# Altium schematic sheet HumRigid1.SchDoc
size A4; SheetNumber: 1; SheetTotal: 2
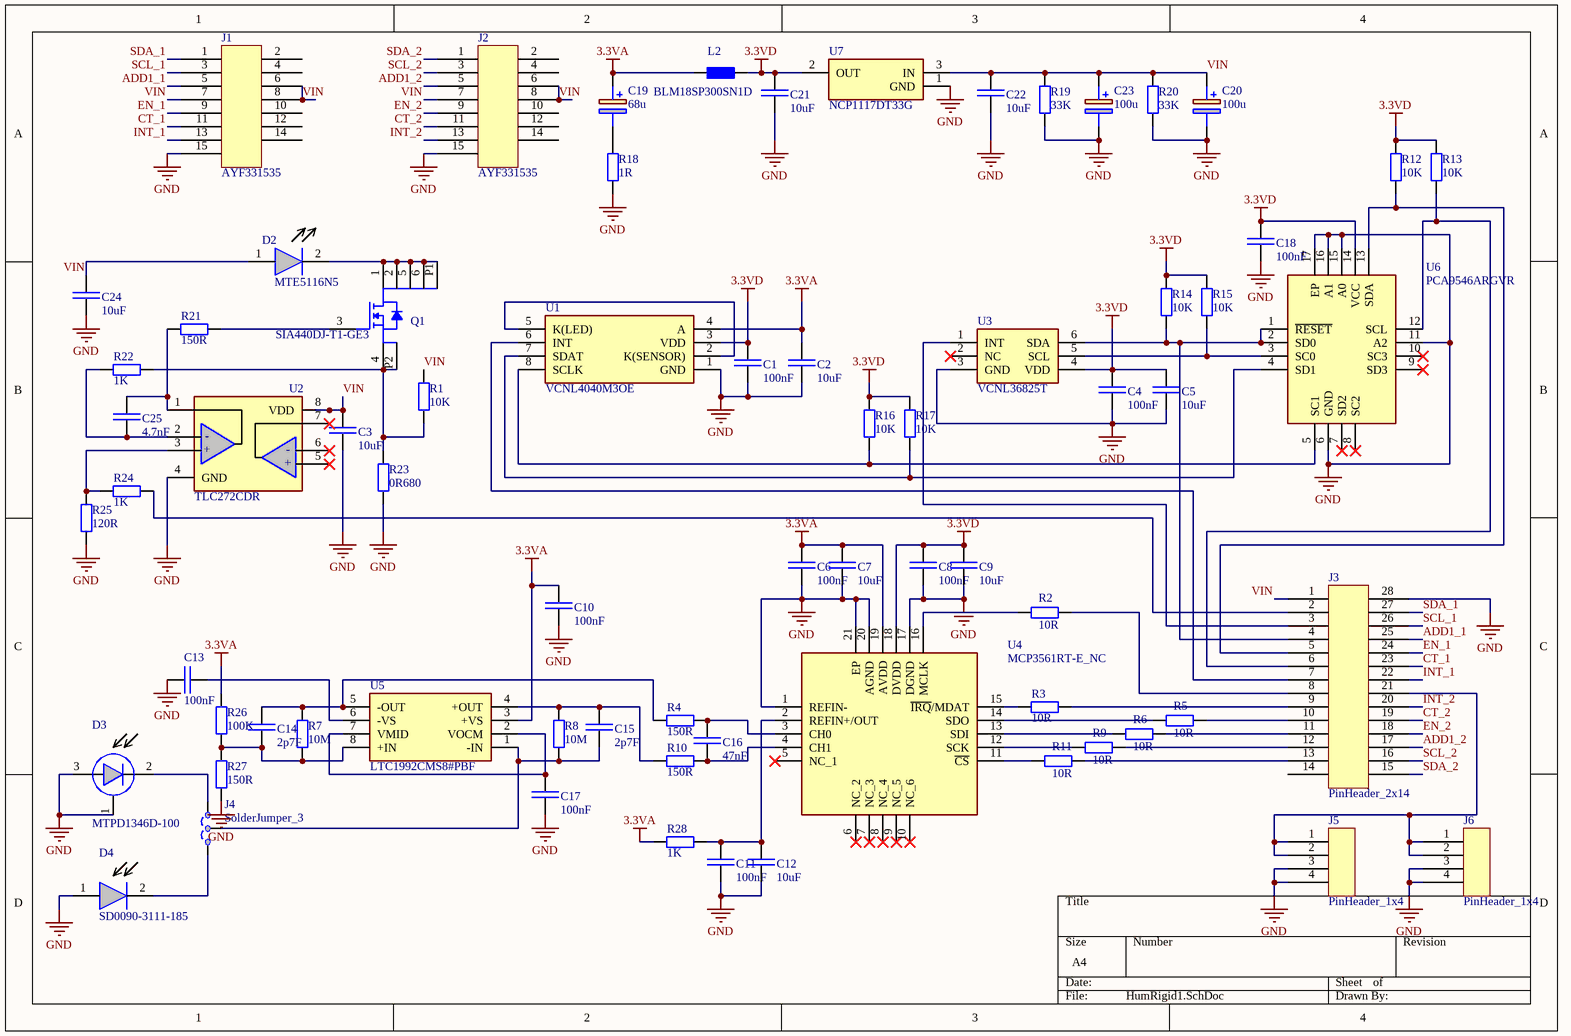
[diagram p0: HumRigid1.SchDoc]

## Parts
C1  100nF  [CAP_SM0603_YAGEOCC2_N]
C2  10uF  [CAP_SM0805_YAGEOCC2_N]
C3  10uF  [CAP_SM0805_YAGEOCC2_N]
C4  100nF  [CAP_SM0603_YAGEOCC2_N]
C5  10uF  [CAP_SM0805_YAGEOCC2_N]
C6  100nF  [CAP_SM0603_YAGEOCC2_N]
C7  10uF  [CAP_SM0805_YAGEOCC2_N]
C8  100nF  [CAP_SM0603_YAGEOCC2_N]
C9  10uF  [CAP_SM0805_YAGEOCC2_N]
C10  100nF  [CAP_SM0603_YAGEOCC2_N]
C11  100nF  [CAP_SM0603_YAGEOCC2_N]
C12  10uF  [CAP_SM0805_YAGEOCC2_N]
C13  100nF  [CAP_SM0603_YAGEOCC2_N]
C14  2p7F  [CAP_SM0603_YAGEOCC2_N]
C15  2p7F  [CAP_SM0603_YAGEOCC2_N]
C16  47nF  [CAP_SM0603_YAGEOCC2_N]
C17  100nF  [CAP_SM0603_YAGEOCC2_N]
C18  100nF  [CAP_SM0603_YAGEOCC2_N]
C19  68u  [CAPAE660X770N]
C20  100u  [CAPAE660X770N]
C21  10uF  [CAP_SM0805_YAGEOCC2_N]
C22  10uF  [CAP_SM0805_YAGEOCC2_N]
C23  100u  [CAPAE660X770N]
C24  10uF  [CAP_SM0805_YAGEOCC2_N]
C25  4.7nF  [CAP_SM0603_YAGEOCC2_N]
D2  MTE5116N5  [MTE5116N5]
D3  MTPD1346D-100  [MTPD1346D100]
D4  SD0090-3111-185  [SD00903111185]
J1  AYF331535  [AYF331535]
J2  AYF331535  [AYF331535]
J3  PinHeader_2x14  [PinHeader_2x14_2.54mm]
J4  SolderJumper_3  [SolderJumper3_1]
J5  PinHeader_1x4  [PinHeader_1x4_2.54mm]
J6  PinHeader_1x4  [PinHeader_1x4_2.54mm]
L2  BLM18SP300SN1D  [Chip2PinSM127P600-8N]
Q1  SIA440DJ-T1-GE3  [SIA440DJT1GE3]
R1  10K  [RES_SM0603_YAGEORC_N]
R2  10R  [RES_SM0603_YAGEORC_N]
R3  10R  [RES_SM0603_YAGEORC_N]
R4  150R  [RES_SM0603_YAGEORC_N]
R5  10R  [RES_SM0603_YAGEORC_N]
R6  10R  [RES_SM0603_YAGEORC_N]
R7  10M  [RES_SM0603_YAGEORC_N]
R8  10M  [RES_SM0603_YAGEORC_N]
R9  10R  [RES_SM0603_YAGEORC_N]
R10  150R  [RES_SM0603_YAGEORC_N]
R11  10R  [RES_SM0603_YAGEORC_N]
R12  10K  [RES_SM0603_YAGEORC_N]
R13  10K  [RES_SM0603_YAGEORC_N]
R14  10K  [RES_SM0603_YAGEORC_N]
R15  10K  [RES_SM0603_YAGEORC_N]
R16  10K  [RES_SM0603_YAGEORC_N]
R17  10K  [RES_SM0603_YAGEORC_N]
R18  1R  [RES_SM0603_YAGEORC_N]
R19  33K  [RES_SM0603_YAGEORC_N]
R20  33K  [RES_SM0603_YAGEORC_N]
R21  150R  [RES_SM0603_YAGEORC_N]
R22  1K  [RES_SM0603_YAGEORC_N]
R23  0R680  [MFLA1206]
R24  1K  [RES_SM0603_YAGEORC_N]
R25  120R  [RES_SM0603_YAGEORC_N]
R26  100K  [RES_SM0603_YAGEORC_N]
R27  150R  [RES_SM0603_YAGEORC_N]
R28  1K  [RES_SM0603_YAGEORC_N]
U1  VCNL4040M3OE  [VCNL4040M3OE]
U2  TLC272CDR  [SOIC127P600X175-8N]
U3  VCNL36825T  [VCNL36825T]
U4  MCP3561RT-E_NC  [QFN40P300X300X60-21N-D]
U5  LTC1992CMS8#PBF  [SOP65P490X110-8N]
U6  PCA9546ARGVR  [QFN65P400X400X100-17N-D]
U7  NCP1117DT33G  [NCP1117DT33G]

## Nets
3.3VA: C2.1 C6.2 C7.2 C10.1 C19.1(+) L2.1 R26.2 R28.1 U1.4(A) U4.19(AVDD) U5.3(+VS)
3.3VD: C1.1 C4.1 C5.1 C8.2 C9.2 C18.2 C21.2 L2.2 R12.2 R13.2 R14.2 R15.2 R16.2 R17.2 U1.3(VDD) U3.4(VDD) U4.18(DVDD) U6.14(VCC) U7.2(OUT)
GND: C1.2 C2.2 C3.2 C4.2 C5.2 C6.1 C7.1 C8.1 C9.1 C10.2 C11.2 C12.2 C13.2 C17.2 C18.1 C20.2(-) C21.1 C22.1 C23.2(-) C24.2 D3.1(Case) D3.3(Anode) D4.1(Anode) J1.15 J2.15 J3.28 J5.3 J5.4 J6.3 J6.4 R18.1 R19.1 R20.1 R23.1 R25.1 R27.1 U1.1(GND) U2.4(GND) U3.3(GND) U4.1(REFIN-) U4.17(DGND) U4.20(AGND) U4.21(EP) U6.6(GND) U6.11(A2) U6.15(A0) U6.16(A1) U6.17(EP) U7.1(GND)
ADD1_1: J1.5 J3.25
ADD1_2: J2.5 J3.17
CT_1: J1.11 J3.23
CT_2: J2.11 J3.19
EN_1: J1.9 J3.24
EN_2: J2.9 J3.18
INT_1: J1.13 J3.22
INT_2: J2.13 J3.20
SCL_1: J1.3 J3.26
SCL_2: J2.3 J3.16
SDA_1: J1.1 J3.27
SDA_2: J2.1 J3.15
VIN: C3.1 C20.1(+) C22.2 C23.1(+) C24.1 D2.1(Anode) J1.6 J1.7 J1.8 J2.6 J2.7 J2.8 J3.1 R1.2 R19.2 R20.2 U2.8(VDD) U7.3(IN)
NetC11_1: C11.1 C12.1 R28.2 U4.2(REFIN+/OUT)
NetC13_1: C13.1 U5.6(-VS)
NetC14_1: C14.1 R4.1 R7.2 U5.5(-OUT)
NetC14_2: C14.2 R7.1 R26.1 R27.2 U5.8(+IN)
NetC15_1: C15.1 R8.2 R10.1 U5.4(+OUT)
NetC15_2: C15.2 J4.1 R8.1 U5.1(-IN)
NetC16_1: C16.1 R4.2 U4.3(CH0)
NetC16_2: C16.2 R10.2 U4.4(CH1)
NetC17_1: C17.1 U5.2(VOCM) U5.7(VMID)
NetC19_2: C19.2(-) R18.2
NetC25_1: C25.1 R22.1 U2.2(1IN-)
NetC25_2: C25.2 R21.1 U2.1(1OUT)
NetD2_2: D2.2(Cathode) Q1.1(D) Q1.2(D) Q1.5(D) Q1.6(D) Q1.P1(D)
NetD3_2: D3.2(Cathode) J4.2
NetD4_2: D4.2(Cathode) J4.3
NetJ3_2: J3.2 R24.2
NetJ3_3: J3.3 U3.1(INT)
NetJ3_4: J3.4 R14.1 U3.6(SDA) U6.1(~{RESET}) U6.2(SD0)
NetJ3_5: J3.5 R12.1 U6.13(SDA)
NetJ3_6: J3.6 R13.1 U6.12(SCL)
NetJ3_7: J3.7 U1.6(INT)
NetJ3_8: J3.8 R2.2
NetJ3_9: J3.9 R3.2
NetJ3_10: J3.10 R5.2
NetJ3_11: J3.11 R6.2
NetJ3_12: J3.12 R9.2
NetJ3_13: J3.13 R11.2
NetJ3_21: J3.21 J5.1 J5.2 J6.1 J6.2
NetQ1_3: Q1.3(G) R21.2
NetQ1_4: Q1.4(S) Q1.P2(S) R1.1 R22.2 R23.2
NetR2_1: R2.1 U4.16(MCLK)
NetR3_1: R3.1 U4.15(~{IRQ}/MDAT)
NetR5_1: R5.1 U4.14(SDO)
NetR6_1: R6.1 U4.13(SDI)
NetR9_1: R9.1 U4.12(SCK)
NetR11_1: R11.1 U4.11(~{CS})
NetR15_1: R15.1 U3.5(SCL) U6.3(SC0)
NetR16_1: R16.1 U1.8(SCLK) U6.5(SC1)
NetR17_1: R17.1 U1.7(SDAT) U6.4(SD1)
NetR24_1: R24.1 R25.2 U2.3(1IN+)
NetU1_2: U1.2(K(SENSOR)) U1.5(K(LED))

Not connected (* = marked no-connect by the designer): J1 2 4 10 12 14; J2 2 4 10 12 14; J3 14; U2 5(2IN+)* 6(2IN-)* 7(2OUT)*; U3 2(NC)*; U4 5(NC_1)* 6(NC_2)* 7(NC_3)* 8(NC_4)* 9(NC_5)* 10(NC_6)*; U6 7(SD2)* 8(SC2)* 9(SD3)* 10(SC3)*

## Notes on the sheet
- (in symbol TLC272CDR) -; +

## Library data of the parts
C1 C4 C6 C8 C10 C11 C13 C17 C18 = CC0603KRX7R9BB104: CAP 100nF SM0603 X7R 50V YAGEO CC2; Tolerance (%): 10; Voltage Rating (Volts): 50; Category: Capacitor; Manufacturer: Yageo; Manufacturer Part Number: CC0603KRX7R9BB104; Package: 0603; Value: 100nF; ComponentLink1URL: http://www.yageo.com; ComponentLink1Description: Manufacturer Website; Supplier 1: Farnell; Supplier Part Number 1: 1362556; Supplier 2: Mouser; Supplier Part Number 2: 603-CC603KRX7R9BB104
C2 C3 C5 C7 C9 C12 C21 C22 C24 = CC0805KKX5R8BB106: CAP 10uF SM0805 X5R 16V YAGEO CC2; Manufacturer Part Number: CC0805KKX7R8BB225; Tolerance (%): 10; Voltage Rating (Volts): 25; Category: Capacitor; Manufacturer: Yageo; Package: 0805; Value: 10uF; Supplier Part Number 1: 1458904; Supplier 1: Farnell; ComponentLink1URL: http://www.yageo.com; ComponentLink1Description: Manufacturer Website; Supplier 2: Digi-Key
C14 C15 = CC0603CRNPO9BN2R7: CAP 2.7pF (2p7F) SM0603 NPO 50V YAGEO CC2; Tolerance (%): 10; Voltage Rating (Volts): 50; Category: Capacitor; Manufacturer: Yageo; Manufacturer Part Number: CC0603CRNPO9BN2R7; Package: 0603; Value: 2p7F; Supplier Part Number 1: 721890; Supplier 1: Farnell; ComponentLink1URL: http://www.yageo.com; ComponentLink1Description: Manufacturer Website; Supplier 2: Digi-Key
C16 = CC0603KRX7R9BB473: CAP 47nF SM0603 X7R 50V YAGEO CC2; Manufacturer Part Number: CC0603KRX7R9BB223; Tolerance (%): 10; Voltage Rating (Volts): 50; Category: Capacitor; Manufacturer: Yageo; Package: 0603; Value: 47nF; ComponentLink1URL: http://www.yageo.com; ComponentLink1Description: Manufacturer Website; Supplier 1: Digi-Key; Supplier Part Number 1: 311-1427-1-ND; Supplier 2: Digi-Key; Supplier Part Number 2: 311-1427-6-ND; Supplier 3: Mouser; Supplier Part Number 3: 603-C0603KRX7R9BB473
C19 = 865080545011: Wurth Elektronik 68uF 35 V dc Aluminium Electrolytic Capacitor, WCAP-ASLI Series 2000h 6.3 (Dia.) x 7.55mm; Manufacturer_Part_Number: 865080545012; Geometry.Height: 7.7mm; Mouser Part Number: 710-865080545012; Mouser Price/Stock: https://www.mouser.co.uk/ProductDetail/Wurth-Elektronik/865080545012?qs=0KOYDY2FL297tvB6LOdg5A%3D%3D; Manufacturer_Name: Wurth Elektronik; Datasheet Link: http://katalog.we-online.de/pbs/datasheet/865080545012.pdf; Value: 68u; Supplier 1: Digi-Key; Supplier Part Number 1: 732-8510-1-ND; Supplier 2: Digi-Key; Supplier Part Number 2: 732-8510-6-ND; Supplier 3: Mouser; Supplier Part Number 3: 710-865080545011
C20 C23 = 865080545012: Wurth Elektronik 100uF 35 V dc Aluminium Electrolytic Capacitor, WCAP-ASLI Series 2000h 6.3 (Dia.) x 7.55mm; Geometry.Height: 7.7mm; Mouser Part Number: 710-865080545012; Mouser Price/Stock: https://www.mouser.co.uk/ProductDetail/Wurth-Elektronik/865080545012?qs=0KOYDY2FL297tvB6LOdg5A%3D%3D; Manufacturer_Name: Wurth Elektronik; Manufacturer_Part_Number: 865080545012; Datasheet Link: http://katalog.we-online.de/pbs/datasheet/865080545012.pdf; Value: 100u; Supplier 1: Digi-Key; Supplier Part Number 1: 732-8511-1-ND; Supplier 2: Digi-Key; Supplier Part Number 2: 732-8511-6-ND; Supplier 3: Mouser; Supplier Part Number 3: 710-865080545012
C25 = CC0603KRX7R9BB472: CAP 4.7nF SM0603 X7R 50V YAGEO CC2; Manufacturer Part Number: CC0603KRX7R9BB223; Tolerance (%): 10; Voltage Rating (Volts): 50; Category: Capacitor; Manufacturer: Yageo; Package: 0603; Value: 4.7nF; ComponentLink1URL: http://www.yageo.com; ComponentLink1Description: Manufacturer Website; Supplier 1: Digi-Key; Supplier Part Number 1: 311-1083-1-ND; Supplier 2: Digi-Key; Supplier Part Number 2: 311-1083-6-ND; Supplier 3: Mouser; Supplier Part Number 3: 603-C0603KRX7R9BB472
D2 = MTE5116N5: MTE5116N5 SWIR Infrared Emitter 1650nm; Supplier 1: Digi-Key; Supplier Part Number 1: 1125-MTE5116N5-ND; Supplier 2: Mouser; Supplier Part Number 2: 193-MTE5116N5
D3 = MTPD1346D-100: MTPD1346D-100 High Speed InGaAs PIN Photodiode 600-1750nm; Supplier 1: Digi-Key; Supplier Part Number 1: 1125-1326-ND; Supplier 2: Mouser; Supplier Part Number 2: 193-MTPD1346D-100
D4 = SD0090-3111-185: SD0090-3111-185 SMD InGaAs Photodiode 900-1650nm; Supplier 1: Mouser; Supplier Part Number 1: 846-0090-3111-185; Supplier 2: Digi-Key; Supplier Part Number 2: 209-0090-3111-185CT-ND; Supplier 3: Digi-Key; Supplier Part Number 3: 209-0090-3111-185DKR-ND
J1 J2 = AYF331535: AYF331535 FFC & FPC-Steckverbinder CONNECTOR SURFACE MOUNT; Supplier 1: Mouser; Supplier Part Number 1: 769-AYF331535; Supplier 2: Digi-Key; Supplier Part Number 2: 255-3053-1-ND
J3 = PinHeader_2x14_2.54mm_1: PinHeader_2x14 2.54mm Pitch
J5 J6 = PinHeader_1x4_2.54mm: PinHeader_1x4 2.54mm Pitch
L2 = BLM18SP300SN1D: Ferrite Beads 0603 30ohm 10% 6A; Manufacturer_Name: Murata Electronics; Geometry.Height: 0.95mm; Mouser Part Number: 81-BLM18SP300SN1D; Mouser Price/Stock: https://www.mouser.co.uk/ProductDetail/Murata-Electronics/BLM18SP300SN1D?qs=W%2FMpXkg%252BdQ4o%252BOP%252B6m8FYA%3D%3D; Manufacturer_Part_Number: BLM18SP300SN1D; Datasheet Link: http://www.murata.com/~/media/webrenewal/support/library/catalog/products/emc/emifil/c31e.ashx?la=en-gb; Supplier 1: Digi-Key; Supplier Part Number 1: 490-BLM18SP300SN1DCT-ND; Supplier 2: Digi-Key; Supplier Part Number 2: 490-BLM18SP300SN1DDKR-ND; Supplier 3: Mouser; Supplier Part Number 3: 81-BLM18SP300SN1D
Q1 = SIA440DJ-T1-GE3: MOSFET 40V Vds 12V Vgs PowerPAK SC-70; Manufacturer_Name: Vishay; Geometry.Height: 0.8mm; Mouser Part Number: 78-SIA440DJ-T1-GE3; Mouser Price/Stock: https://www.mouser.co.uk/ProductDetail/Vishay-Semiconductors/SIA440DJ-T1-GE3?qs=c9a7l%2FSwUkKwNKYQuCLipQ%3D%3D; Manufacturer_Part_Number: SIA440DJ-T1-GE3; Datasheet Link: https://www.arrow.com/en/products/sia440dj-t1-ge3/vishay; Supplier 1: Mouser; Supplier Part Number 1: 78-SIA440DJ-T1-GE3; Supplier 2: Digi-Key; Supplier Part Number 2: SIA440DJ-T1-GE3CT-ND; Supplier 3: Digi-Key; Supplier Part Number 3: SIA440DJ-T1-GE3DKR-ND
R1 R12-R17 = RC0603FR-0710KL: RES 10K SM0603 YAGEO RC_L; Power (Watts): 0.1; Resistance (Ohms): 10000; Tolerance (%): 1; Category: Resistor; Manufacturer: Yageo; Manufacturer Part Number: RC0603FR-0710KL; Package: 0603; Value: 10K; Supplier Part Number 1: 9238603; Supplier 1: Farnell; ComponentLink1URL: http://www.yageo.com; ComponentLink1Description: Manufacturer Website; Supplier 2: Digi-Key; Supplier Part Number 2: 311-10.0KHRCT-ND
R2 R3 R5 R6 R9 R11 = RC0603FR-0710RL: RES 10R SM0603 YAGEO RC_L; Power (Watts): 0.1; Resistance (Ohms): 10; Tolerance (%): 1; Category: Resistor; Manufacturer: Yageo; Manufacturer Part Number: RC0603FR-0710RL; Package: 0603; Value: 10R; Supplier Part Number 1: 9238247; Supplier 1: Farnell; ComponentLink1URL: http://www.yageo.com; ComponentLink1Description: Manufacturer Website; Supplier 2: Digi-Key; Supplier Part Number 2: 311-10.0HRCT-ND
R4 R10 R21 R27 = RC0603FR-07150RL: RES 150R SM0603 YAGEO RC_L; Power (Watts): 0.1; Resistance (Ohms): 150; Tolerance (%): 1; Category: Resistor; Manufacturer: Yageo; Manufacturer Part Number: RC0603FR-07150RL; Package: 0603; Value: 150R; Supplier Part Number 1: 9238387; Supplier 1: Farnell; ComponentLink1URL: http://www.yageo.com; ComponentLink1Description: Manufacturer Website; Supplier 2: Digi-Key; Supplier Part Number 2: 311-150HRCT-ND
R7 R8 = RC0603FR-0710ML: RES 10M SM0603 YAGEO RC_L; Power (Watts): 0.1; Resistance (Ohms): 10000000; Tolerance (%): 1; Category: Resistor; Manufacturer: Yageo; Manufacturer Part Number: RC0603FR-0710ML; Package: 0603; Value: 10M; Supplier Part Number 1: 9238964; Supplier 1: Farnell; ComponentLink1URL: http://www.yageo.com; ComponentLink1Description: Manufacturer Website; Supplier 2: Digi-Key; Supplier Part Number 2: 311-10.0MHRCT-ND
R18 = RC0603FR-071RL: RES 1R SM0603YAGEO RC_L; Manufacturer: Yageo; Manufacturer Part Number: RC0805FR-0710RL; Power (Watts): 0.125; Resistance (Ohms): 10; Tolerance (%): 1; Category: Resistor; Package: 0805; Value: 1R; ComponentLink1Description: Manufacturer Website; ComponentLink1URL: http://www.yageo.com; Supplier 1: Digi-Key; Supplier Part Number 1: 311-1.00HRCT-ND; Supplier 2: Digi-Key; Supplier Part Number 2: 311-1.00HRDKR-ND; Supplier 3: Mouser; Supplier Part Number 3: 603-RC0603FR-071RL
R19 R20 = RC0603FR-0733KL: RES 33K SM0603 YAGEO RC_L; Power (Watts): 0.1; Resistance (Ohms): 33000; Tolerance (%): 1; Category: Resistor; Manufacturer: Yageo; Manufacturer Part Number: RC0603FR-0733KL; Package: 0603; Value: 33K; Supplier Part Number 1: 9238662; Supplier 1: Farnell; ComponentLink1URL: http://www.yageo.com; ComponentLink1Description: Manufacturer Website; Supplier 2: Digi-Key; Supplier Part Number 2: 311-33.0KHRCT-ND
R22 R24 R28 = RC0603FR-071KL: RES 1K SM0603 YAGEO RC_L; Power (Watts): 0.1; Resistance (Ohms): 1000; Tolerance (%): 1; Category: Resistor; Manufacturer: Yageo; Manufacturer Part Number: RC0603FR-071KL; Package: 0603; Value: 1K; Supplier Part Number 1: 9238484; Supplier 1: Farnell; ComponentLink1URL: http://www.yageo.com; ComponentLink1Description: Manufacturer Website; Supplier 2: Digi-Key; Supplier Part Number 2: 311-1.00KHRCT-ND
R23 = MFLA1206R6800FS: RES 0R680 SM1206 Eaton 500mW; Manufacturer: Yageo; Manufacturer Part Number: RC0603FR-07150RL; Power (Watts): 0.1; Resistance (Ohms): 150; Tolerance (%): 1; Category: Resistor; Package: 0603; Value: 0R680; ComponentLink1URL: http://www.yageo.com; ComponentLink1Description: Manufacturer Website; Supplier 1: Digi-Key; Supplier Part Number 1: 283-MFLA1206R6800FSCT-ND; Supplier 2: Digi-Key; Supplier Part Number 2: 283-MFLA1206R6800FSDKR-ND; Supplier 3: Mouser; Supplier Part Number 3: 504-MFLA1206R6800FS
R25 = RC0603FR-07120RL: RES 120R SM0603 YAGEO RC_L; Power (Watts): 0.1; Resistance (Ohms): 120; Tolerance (%): 1; Category: Resistor; Manufacturer: Yageo; Manufacturer Part Number: RC0603FR-07120RL; Package: 0603; Value: 120R; Supplier Part Number 1: 9238379; Supplier 1: Farnell; ComponentLink1URL: http://www.yageo.com; ComponentLink1Description: Manufacturer Website; Supplier 2: Digi-Key; Supplier Part Number 2: 311-120HRCT-ND
R26 = RC0603FR-13100KL: RES 100K SM0603 YAGEO RC_L; Power (Watts): 0.1; Resistance (Ohms): 100000; Tolerance (%): 1; Category: Resistor; Manufacturer: Yageo; Manufacturer Part Number: RC0603FR-13100KL; Package: 0603; Value: 100K; Supplier Part Number 1: 2309107; Supplier 1: Farnell; ComponentLink1URL: http://www.yageo.com; ComponentLink1Description: Manufacturer Website; Supplier 2: Digi-Key
U1 = VCNL4040M3OE: Fully Integrated Proximity and Ambient Light Sensor with Infrared Emitter, I2C Interface, and Interrupt Function; Manufacturer_Name: Vishay; Geometry.Height: 1.15mm; Mouser Part Number: 78-VCNL4040M3OE; Mouser Price/Stock: https://www.mouser.co.uk/ProductDetail/Vishay-Semiconductors/VCNL4040M3OE?qs=p1ya7m3AA0C%252Buyxak4%252Bv6g%3D%3D; Manufacturer_Part_Number: VCNL4040M3OE; Datasheet Link: http://www.vishay.com/docs/84274/vcnl4040.pdf; Supplier 1: Mouser; Supplier Part Number 1: 78-VCNL4040M3OE; Supplier 2: Digi-Key; Supplier Part Number 2: VCNL4040M3OECT-ND; Supplier 3: Digi-Key; Supplier Part Number 3: VCNL4040M3OEDKR-ND
U2 = TLC272CDR: TLC272CDRG4, Dual Operational Amplifier 1.7MHz CMOS 5 to 15V, 8-Pin SOIC; Manufacturer_Name: Texas Instruments; Geometry.Height: 1.75mm; Mouser Part Number: 595-TLC272CDR; Mouser Price/Stock: https://www.mouser.co.uk/ProductDetail/Texas-Instruments/TLC272CDR?qs=xJkDX%2FqrskPeOaaOE3DKWA%3D%3D; Manufacturer_Part_Number: TLC272CDR; Datasheet Link: http://www.ti.com/lit/ds/symlink/tlc272.pdf; Supplier 1: Mouser; Supplier Part Number 1: 595-TLC272CDR; Supplier 2: Digi-Key; Supplier Part Number 2: 296-1310-1-ND; Supplier 3: Digi-Key; Supplier Part Number 3: 296-1310-6-ND
U3 = VCNL36825T: Proximity Sensors PROX SENS INTER VCSEL I2C-E4, IC SENSORS; Manufacturer_Name: Vishay; Geometry.Height: 0.6mm; Mouser Part Number: 78-VCNL36825T; Mouser Price/Stock: https://www.mouser.co.uk/ProductDetail/Vishay-Semiconductors/VCNL36825T?qs=pUKx8fyJudAlmgCr9cmOAQ%3D%3D; Manufacturer_Part_Number: VCNL36825T; Datasheet Link: https://www.vishay.com/docs/80235/vcnl36825t.pdf; Supplier 1: Mouser; Supplier Part Number 1: 78-VCNL36825T; Supplier 2: Digi-Key; Supplier Part Number 2: 751-VCNL36825TCT-ND; Supplier 3: Digi-Key; Supplier Part Number 3: 751-VCNL36825TDKR-ND
U4 = MCP3561RT-E_NC: Microchip, 24 bit- ADC 153.6ksps, 20-Pin UQFN; Manufacturer_Part_Number: MCP3561RT-E/NC; Geometry.Height: 0.6mm; Mouser Part Number: 579-MCP3561RT-E/NC; Mouser Price/Stock: https://www.mouser.co.uk/ProductDetail/Microchip-Technology-Atmel/MCP3561RT-E-NC?qs=W%2FMpXkg%252BdQ521c60%252BgBGPA%3D%3D; Manufacturer_Name: Microchip; Datasheet Link: https://www.microchip.com/content/dam/mchp/documents/APID/ProductDocuments/DataSheets/MCP3561_2_4R-Data-Sheet-DS200006391C.pdf; Supplier 1: Digi-Key; Supplier Part Number 1: 150-MCP3561RT-E/NCCT-ND; Supplier 2: Digi-Key; Supplier Part Number 2: 150-MCP3561RT-E/NCDKR-ND; Supplier 3: Mouser; Supplier Part Number 3: 579-MCP3561RT-E/NC
U5 = LTC1992CMS8#PBF: LTC1992CMS8#PBF Analog Devices, Differential Amplifier 3MHz Rail to Rail Output 8-Pin MSOP; Geometry.Height: 1.1mm; Mouser Part Number: 584-LTC1992CMS8#PBF; Mouser Price/Stock: https://www.mouser.co.uk/ProductDetail/Analog-Devices/LTC1992CMS8PBF?qs=hVkxg5c3xu9zI7TrZNbtXw%3D%3D; Manufacturer_Name: Analog Devices; Manufacturer_Part_Number: LTC1992CMS8#PBF; Datasheet Link: *; Supplier 1: Digi-Key; Supplier Part Number 1: 505-LTC1992CMS8#PBF-ND; Supplier 2: Mouser; Supplier Part Number 2: 584-LTC1992CMS8#PBF
U6 = PCA9546ARGVR: 4-Channel I2C And SMBus Switch With Reset Functions; Manufacturer_Name: Texas Instruments; Geometry.Height: 1mm; Mouser Part Number: 595-PCA9546ARGVR; Mouser Price/Stock: https://www.mouser.co.uk/ProductDetail/Texas-Instruments/PCA9546ARGVR?qs=iSMark9AYDVOIxSBd0ujBA%3D%3D; Manufacturer_Part_Number: PCA9546ARGVR; Datasheet Link: http://www.ti.com/lit/gpn/pca9546a; Supplier 1: Mouser; Supplier Part Number 1: 595-PCA9546ARGVR; Supplier 2: Digi-Key; Supplier Part Number 2: 296-21771-1-ND; Supplier 3: Digi-Key; Supplier Part Number 3: 296-21771-6-ND
U7 = NCP1117DT33G: Linear Voltage Regulator IC Positive Fixed 1 Output 1A DPAK; Manufacturer_Name: onsemi; Geometry.Height: 2.51mm; Mouser Part Number: 863-NCP1117DT33G; Mouser Price/Stock: https://www.mouser.co.uk/ProductDetail/onsemi/NCP1117DT33G?qs=Gev%252BmEvV0ib8cFCgG6Q0fQ%3D%3D; Manufacturer_Part_Number: NCP1117DT33G; Datasheet Link: https://www.onsemi.com/pdf/datasheet/ncp1117-d.pdf; Supplier 1: Mouser; Supplier Part Number 1: 863-NCP1117DT33G; Supplier 2: Digi-Key; Supplier Part Number 2: NCP1117DT33GOS-ND